# EAGLE schematic multifeedback 8k lowpass (EAGLE 6.2)
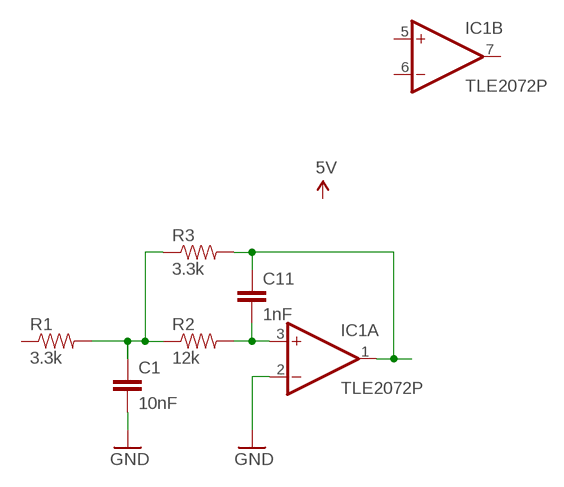
[diagram p0: schematic, sheet 1]

## Parts
C1  10nF  CAPPTH  [CAP-PTH-SMALL]
C11  1nF  CAPPTH  [CAP-PTH-SMALL]
IC1  TLE2072P  [DIL08]
R1  3.3k  RESISTORPTH-1/6W  [1/6W-RES]
R2  12k  RESISTORPTH-1/6W  [1/6W-RES]
R3  3.3k  RESISTORPTH-1/6W  [1/6W-RES]

## Nets
GND: C1.2 IC1.2(A:-IN)
N$1: C11.1 IC1.1(A:OUT) R3.2
N$2: C11.2 IC1.3(A:+IN) R2.2
N$3: C1.1 R1.2 R2.1 R3.1
Unconnected: IC1.5(B:+IN) IC1.6(B:-IN) IC1.7(B:OUT) R1.1

## Power pins joined to a net without a drawn wire
V+: IC1.8(P:V+)
V-: IC1.4(P:V-)

## Library data of the parts
C1 C11 = SparkFun:CAP: Capacitor Standard 0603 ceramic capacitor, and 0.1" leaded capacitor.
IC1 = My Library:TLE2072: OP AMP
R1-R3 = My Library:RESISTOR: Resistor Basic schematic elements and footprints for 0603, 1206, and PTH resistors.